# Altium schematic sheet SCROD_CONN_A2.SchDoc: SCROD_CONN
size 401 x 291 mm; DocumentNumber: 3; SheetNumber: 3; SheetTotal: 3
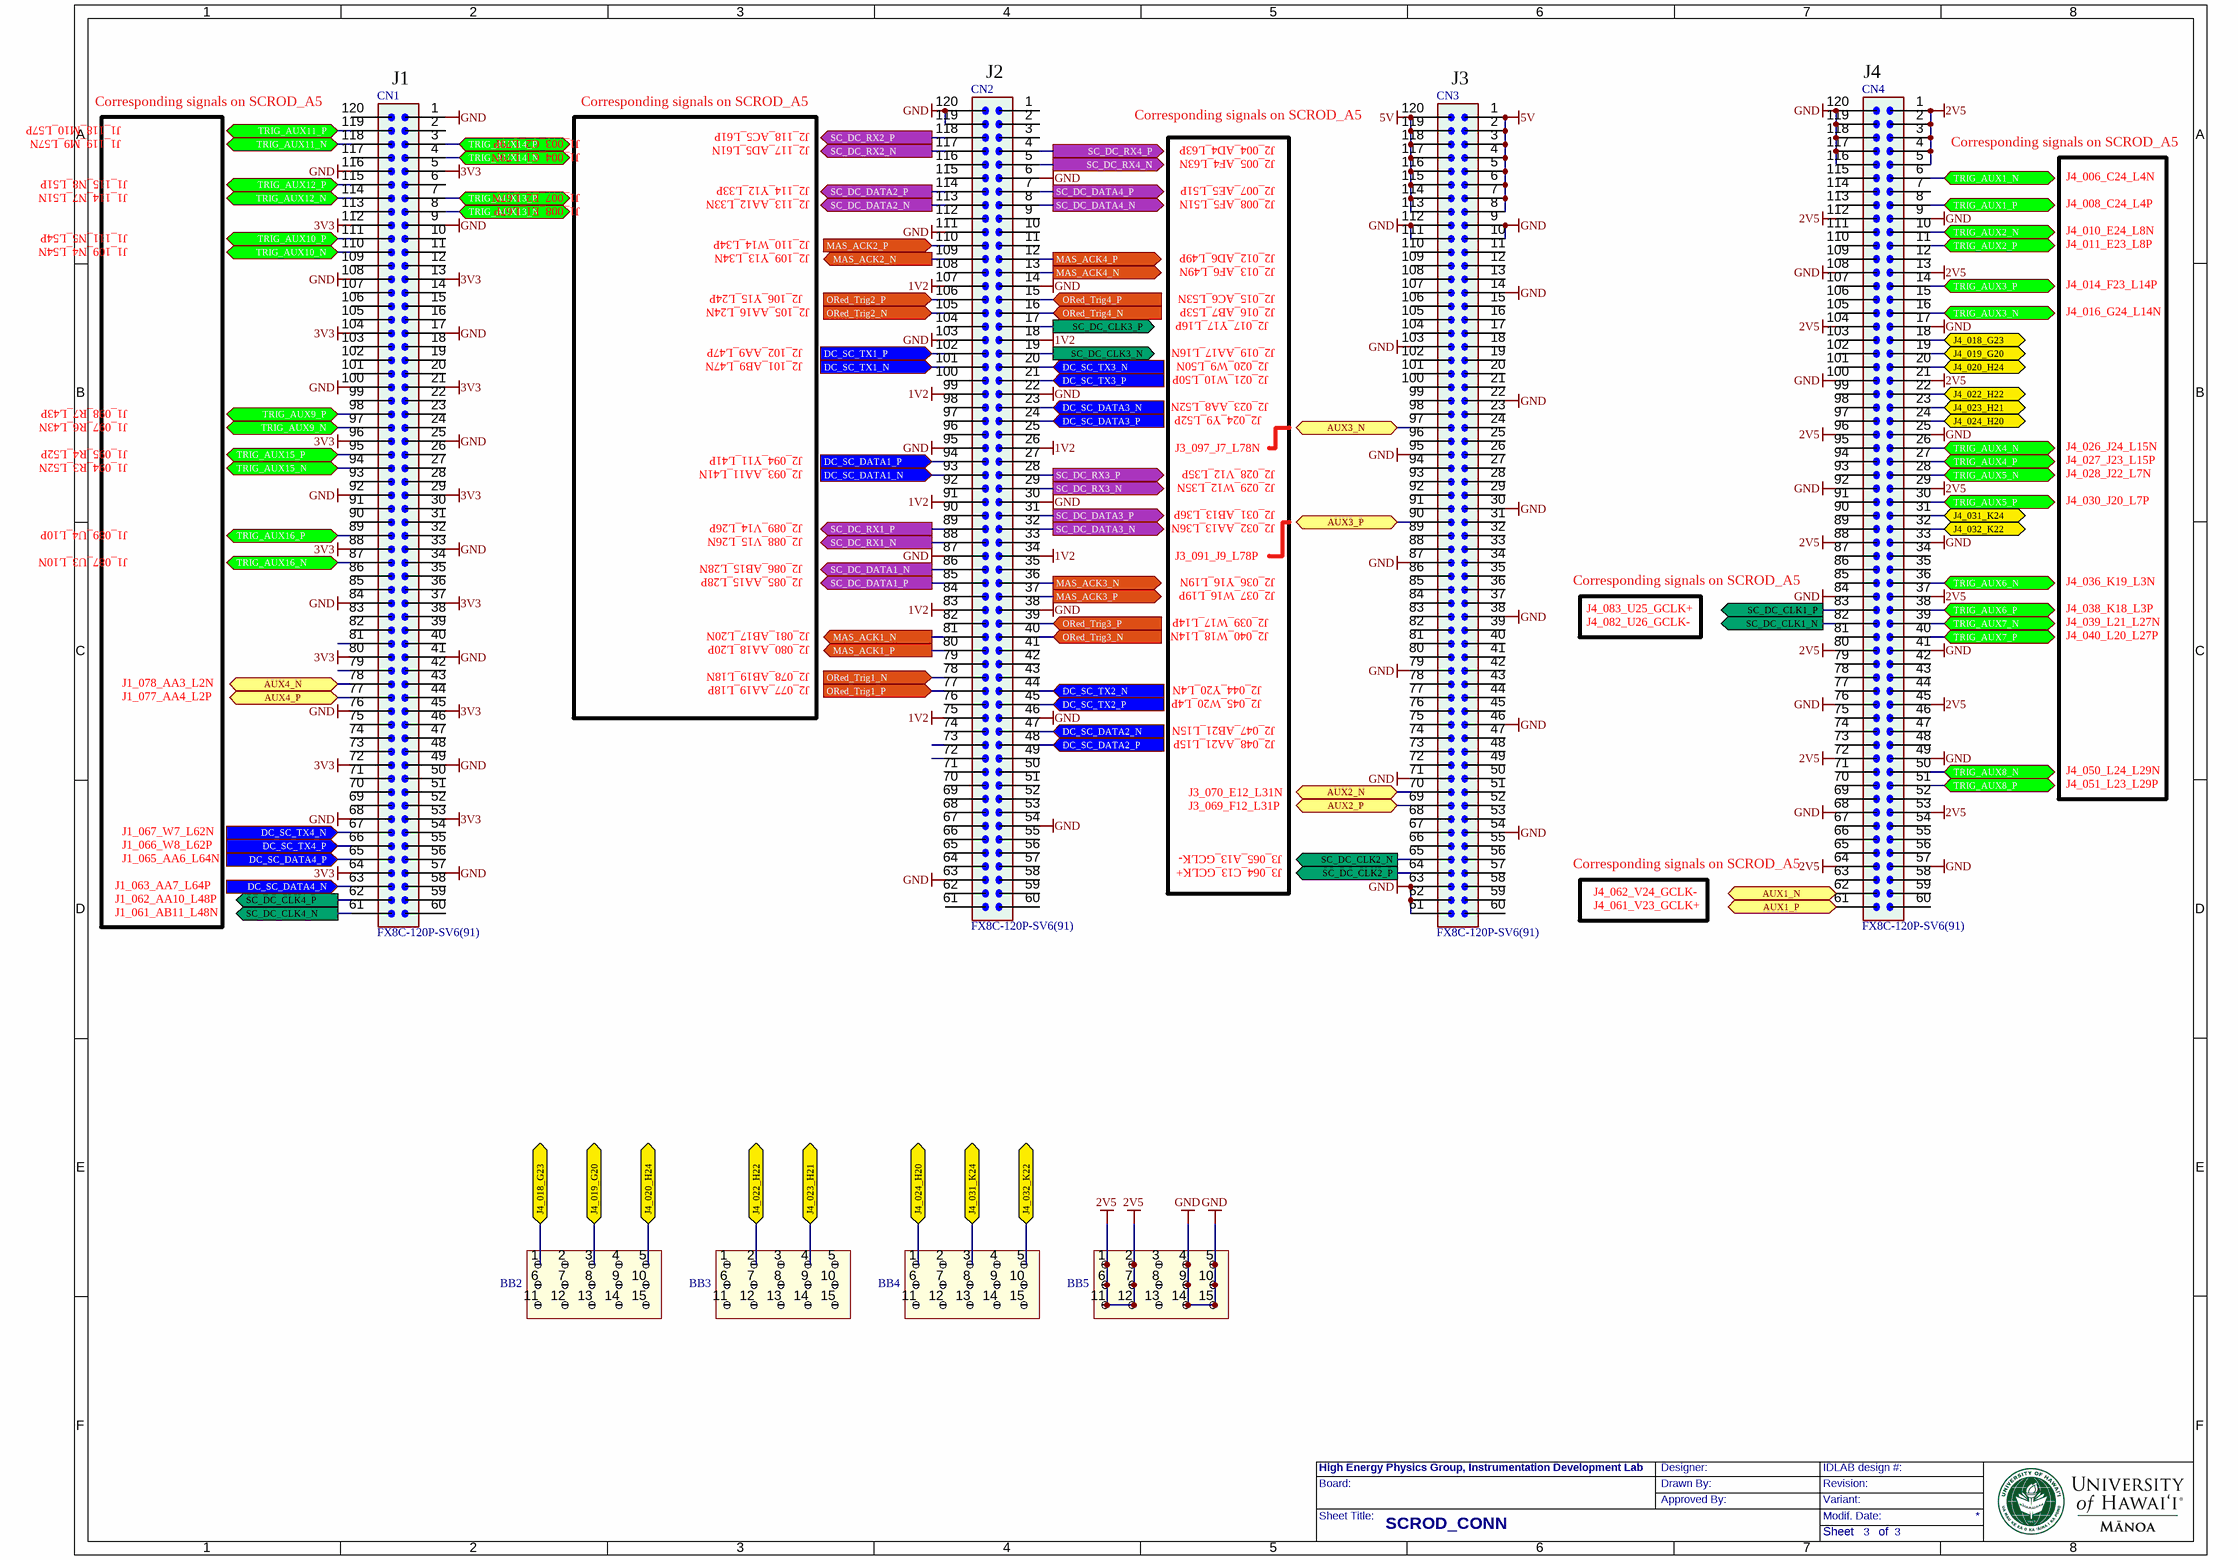
[diagram p0: SCROD_CONN_A2.SchDoc]

## Parts
BB2  (no value)  [Breadboard_3x5_100mil_pitch]
BB3  (no value)  [Breadboard_3x5_100mil_pitch]
BB4  (no value)  [Breadboard_3x5_100mil_pitch]
BB5  (no value)  [Breadboard_3x5_100mil_pitch]
CN1  FX8C-120P-SV6(91)  [FX8C-120P-SV6(91)]
CN2  FX8C-120P-SV6(91)  [FX8C-120P-SV6(91)]
CN3  FX8C-120P-SV6(91)  [FX8C-120P-SV6(91)]
CN4  FX8C-120P-SV6(91)  [FX8C-120P-SV6(91)]

## Ports
AUX1_N (bidir), AUX1_P (bidir), AUX2_N (bidir), AUX2_P (bidir), AUX3_N (bidir), AUX3_P (bidir), AUX4_N (bidir), AUX4_P (bidir), DC_SC_DATA1_N (in), DC_SC_DATA1_P (in), DC_SC_DATA2_N (in), DC_SC_DATA2_P (in), DC_SC_DATA3_N (in), DC_SC_DATA3_P (in), DC_SC_DATA4_N (in), DC_SC_DATA4_P (in), DC_SC_TX1_N (in), DC_SC_TX1_P (in), DC_SC_TX2_N (in), DC_SC_TX2_P (in), DC_SC_TX3_N (in), DC_SC_TX3_P (in), DC_SC_TX4_N (in), DC_SC_TX4_P (in), J4_018_G23 (bidir), J4_019_G20 (bidir), J4_020_H24 (bidir), J4_022_H22 (bidir), J4_023_H21 (bidir), J4_024_H20 (bidir), J4_031_K24 (bidir), J4_032_K22 (bidir), MAS_ACK1_N (out), MAS_ACK1_P (out), MAS_ACK2_N (out), MAS_ACK2_P (in), MAS_ACK3_N (out), MAS_ACK3_P (out), MAS_ACK4_N (out), MAS_ACK4_P (out), ORed_Trig1_N (in), ORed_Trig1_P (in), ORed_Trig2_N (in), ORed_Trig2_P (in), ORed_Trig3_N (in), ORed_Trig3_P (in), ORed_Trig4_N (in), ORed_Trig4_P (in), SC_DC_CLK1_N (out), SC_DC_CLK1_P (out), SC_DC_CLK2_N (out), SC_DC_CLK2_P (out), SC_DC_CLK3_N (out), SC_DC_CLK3_P (out), SC_DC_CLK4_N (out), SC_DC_CLK4_P (out), SC_DC_DATA1_N (out), SC_DC_DATA1_P (out), SC_DC_DATA2_N (out), SC_DC_DATA2_P (out), SC_DC_DATA3_N (out), SC_DC_DATA3_P (out), SC_DC_DATA4_N (out), SC_DC_DATA4_P (out), SC_DC_RX1_N (out), SC_DC_RX1_P (out), SC_DC_RX2_N (out), SC_DC_RX2_P (out), SC_DC_RX3_N (out), SC_DC_RX3_P (out), SC_DC_RX4_N (out), SC_DC_RX4_P (out), TRIG_AUX1_N (bidir), TRIG_AUX1_P (bidir), TRIG_AUX2_N (bidir), TRIG_AUX2_P (bidir), TRIG_AUX3_N (bidir), TRIG_AUX3_P (bidir), TRIG_AUX4_N (bidir), TRIG_AUX4_P (bidir), TRIG_AUX5_N (bidir), TRIG_AUX5_P (bidir), TRIG_AUX6_N (bidir), TRIG_AUX6_P (bidir), TRIG_AUX7_N (bidir), TRIG_AUX7_P (bidir), TRIG_AUX8_N (bidir), TRIG_AUX8_P (bidir), TRIG_AUX9_N (bidir), TRIG_AUX9_P (bidir), TRIG_AUX10_N (bidir), TRIG_AUX10_P (bidir), TRIG_AUX11_N (bidir), TRIG_AUX11_P (bidir), TRIG_AUX12_N (bidir), TRIG_AUX12_P (bidir), TRIG_AUX13_N (bidir), TRIG_AUX13_P (bidir), TRIG_AUX14_N (bidir), TRIG_AUX14_P (bidir), TRIG_AUX15_N (bidir), TRIG_AUX15_P (bidir), TRIG_AUX16_N (bidir), TRIG_AUX16_P (bidir)

## Nets
1V2: CN2.18 CN2.26 CN2.34 CN2.75 CN2.83 CN2.91 CN2.99 CN2.107
2V5: BB5.1 BB5.2 BB5.6 BB5.7 BB5.11 BB5.12 CN4.1 CN4.2 CN4.3 CN4.4 CN4.5 CN4.13 CN4.21 CN4.29 CN4.37 CN4.45 CN4.53 CN4.64 CN4.72 CN4.80 CN4.88 CN4.96 CN4.104 CN4.112
3V3: CN1.5 CN1.13 CN1.21 CN1.29 CN1.37 CN1.45 CN1.53 CN1.64 CN1.72 CN1.80 CN1.88 CN1.96 CN1.104 CN1.112
5V: CN3.1 CN3.2 CN3.3 CN3.4 CN3.5 CN3.6 CN3.7 CN3.8 CN3.113 CN3.114 CN3.115 CN3.116 CN3.117 CN3.118 CN3.119 CN3.120
GND: BB5.4 BB5.5 BB5.9 BB5.10 BB5.14 BB5.15 CN1.1 CN1.9 CN1.17 CN1.25 CN1.33 CN1.41 CN1.49 CN1.57 CN1.68 CN1.76 CN1.84 CN1.92 CN1.100 CN1.108 CN1.116 CN2.6 CN2.14 CN2.22 CN2.30 CN2.38 CN2.46 CN2.54 CN2.63 CN2.87 CN2.95 CN2.103 CN2.111 CN2.119 CN2.120 CN3.9 CN3.10 CN3.14 CN3.22 CN3.30 CN3.38 CN3.46 CN3.54 CN3.61 CN3.62 CN3.63 CN3.71 CN3.79 CN3.87 CN3.95 CN3.103 CN3.111 CN3.112 CN4.9 CN4.17 CN4.25 CN4.33 CN4.41 CN4.49 CN4.57 CN4.68 CN4.76 CN4.84 CN4.92 CN4.100 CN4.108 CN4.116 CN4.117 CN4.118 CN4.119 CN4.120
AUX1_N: CN4.62 ; port AUX1_N
AUX1_P: CN4.61 ; port AUX1_P
AUX2_N: CN3.70 ; port AUX2_N
AUX2_P: CN3.69 ; port AUX2_P
AUX3_N: CN3.97 ; port AUX3_N
AUX3_P: CN3.90 ; port AUX3_P
AUX4_N: CN1.78 ; port AUX4_N
AUX4_P: CN1.77 ; port AUX4_P
DC_SC_DATA1_N: CN2.93 ; port DC_SC_DATA1_N
DC_SC_DATA1_P: CN2.94 ; port DC_SC_DATA1_P
DC_SC_DATA2_N: CN2.47 ; port DC_SC_DATA2_N
DC_SC_DATA2_P: CN2.48 ; port DC_SC_DATA2_P
DC_SC_DATA3_N: CN2.23 ; port DC_SC_DATA3_N
DC_SC_DATA3_P: CN2.24 ; port DC_SC_DATA3_P
DC_SC_DATA4_N: CN1.63 ; port DC_SC_DATA4_N
DC_SC_DATA4_P: CN1.65 ; port DC_SC_DATA4_P
DC_SC_TX1_N: CN2.101 ; port DC_SC_TX1_N
DC_SC_TX1_P: CN2.102 ; port DC_SC_TX1_P
DC_SC_TX2_N: CN2.44 ; port DC_SC_TX2_N
DC_SC_TX2_P: CN2.45 ; port DC_SC_TX2_P
DC_SC_TX3_N: CN2.20 ; port DC_SC_TX3_N
DC_SC_TX3_P: CN2.21 ; port DC_SC_TX3_P
DC_SC_TX4_N: CN1.67 ; port DC_SC_TX4_N
DC_SC_TX4_P: CN1.66 ; port DC_SC_TX4_P
J4_018_G23: BB2.1 CN4.18 ; port J4_018_G23
J4_019_G20: BB2.3 CN4.19 ; port J4_019_G20
J4_020_H24: BB2.5 CN4.20 ; port J4_020_H24
J4_022_H22: BB3.2 CN4.22 ; port J4_022_H22
J4_023_H21: BB3.4 CN4.23 ; port J4_023_H21
J4_024_H20: BB4.1 CN4.24 ; port J4_024_H20
J4_031_K24: BB4.3 CN4.31 ; port J4_031_K24
J4_032_K22: BB4.5 CN4.32 ; port J4_032_K22
MAS_ACK1_N: CN2.81 ; port MAS_ACK1_N
MAS_ACK1_P: CN2.80 ; port MAS_ACK1_P
MAS_ACK2_N: CN2.109 ; port MAS_ACK2_N
MAS_ACK2_P: CN2.110 ; port MAS_ACK2_P
MAS_ACK3_N: CN2.36 ; port MAS_ACK3_N
MAS_ACK3_P: CN2.37 ; port MAS_ACK3_P
MAS_ACK4_N: CN2.13 ; port MAS_ACK4_N
MAS_ACK4_P: CN2.12 ; port MAS_ACK4_P
ORed_Trig1_N: CN2.78 ; port ORed_Trig1_N
ORed_Trig1_P: CN2.77 ; port ORed_Trig1_P
ORed_Trig2_N: CN2.105 ; port ORed_Trig2_N
ORed_Trig2_P: CN2.106 ; port ORed_Trig2_P
ORed_Trig3_N: CN2.40 ; port ORed_Trig3_N
ORed_Trig3_P: CN2.39 ; port ORed_Trig3_P
ORed_Trig4_N: CN2.16 ; port ORed_Trig4_N
ORed_Trig4_P: CN2.15 ; port ORed_Trig4_P
SC_DC_CLK1_N: CN4.82 ; port SC_DC_CLK1_N
SC_DC_CLK1_P: CN4.83 ; port SC_DC_CLK1_P
SC_DC_CLK2_N: CN3.65 ; port SC_DC_CLK2_N
SC_DC_CLK2_P: CN3.64 ; port SC_DC_CLK2_P
SC_DC_CLK3_N: CN2.19 ; port SC_DC_CLK3_N
SC_DC_CLK3_P: CN2.17 ; port SC_DC_CLK3_P
SC_DC_CLK4_N: CN1.61 ; port SC_DC_CLK4_N
SC_DC_CLK4_P: CN1.62 ; port SC_DC_CLK4_P
SC_DC_DATA1_N: CN2.86 ; port SC_DC_DATA1_N
SC_DC_DATA1_P: CN2.85 ; port SC_DC_DATA1_P
SC_DC_DATA2_N: CN2.113 ; port SC_DC_DATA2_N
SC_DC_DATA2_P: CN2.114 ; port SC_DC_DATA2_P
SC_DC_DATA3_N: CN2.32 ; port SC_DC_DATA3_N
SC_DC_DATA3_P: CN2.31 ; port SC_DC_DATA3_P
SC_DC_DATA4_N: CN2.8 ; port SC_DC_DATA4_N
SC_DC_DATA4_P: CN2.7 ; port SC_DC_DATA4_P
SC_DC_RX1_N: CN2.88 ; port SC_DC_RX1_N
SC_DC_RX1_P: CN2.89 ; port SC_DC_RX1_P
SC_DC_RX2_N: CN2.117 ; port SC_DC_RX2_N
SC_DC_RX2_P: CN2.118 ; port SC_DC_RX2_P
SC_DC_RX3_N: CN2.29 ; port SC_DC_RX3_N
SC_DC_RX3_P: CN2.28 ; port SC_DC_RX3_P
SC_DC_RX4_N: CN2.5 ; port SC_DC_RX4_N
SC_DC_RX4_P: CN2.4 ; port SC_DC_RX4_P
TRIG_AUX1_N: CN4.6 ; port TRIG_AUX1_N
TRIG_AUX1_P: CN4.8 ; port TRIG_AUX1_P
TRIG_AUX2_N: CN4.10 ; port TRIG_AUX2_N
TRIG_AUX2_P: CN4.11 ; port TRIG_AUX2_P
TRIG_AUX3_N: CN4.16 ; port TRIG_AUX3_N
TRIG_AUX3_P: CN4.14 ; port TRIG_AUX3_P
TRIG_AUX4_N: CN4.26 ; port TRIG_AUX4_N
TRIG_AUX4_P: CN4.27 ; port TRIG_AUX4_P
TRIG_AUX5_N: CN4.28 ; port TRIG_AUX5_N
TRIG_AUX5_P: CN4.30 ; port TRIG_AUX5_P
TRIG_AUX6_N: CN4.36 ; port TRIG_AUX6_N
TRIG_AUX6_P: CN4.38 ; port TRIG_AUX6_P
TRIG_AUX7_N: CN4.39 ; port TRIG_AUX7_N
TRIG_AUX7_P: CN4.40 ; port TRIG_AUX7_P
TRIG_AUX8_N: CN4.50 ; port TRIG_AUX8_N
TRIG_AUX8_P: CN4.51 ; port TRIG_AUX8_P
TRIG_AUX9_N: CN1.97 ; port TRIG_AUX9_N
TRIG_AUX9_P: CN1.98 ; port TRIG_AUX9_P
TRIG_AUX10_N: CN1.110 ; port TRIG_AUX10_N
TRIG_AUX10_P: CN1.111 ; port TRIG_AUX10_P
TRIG_AUX11_N: CN1.118 ; port TRIG_AUX11_N
TRIG_AUX11_P: CN1.119 ; port TRIG_AUX11_P
TRIG_AUX12_N: CN1.114 ; port TRIG_AUX12_N
TRIG_AUX12_P: CN1.115 ; port TRIG_AUX12_P
TRIG_AUX13_N: CN1.8 ; port TRIG_AUX13_N
TRIG_AUX13_P: CN1.7 ; port TRIG_AUX13_P
TRIG_AUX14_N: CN1.4 ; port TRIG_AUX14_N
TRIG_AUX14_P: CN1.3 ; port TRIG_AUX14_P
TRIG_AUX15_N: CN1.94 ; port TRIG_AUX15_N
TRIG_AUX15_P: CN1.95 ; port TRIG_AUX15_P
TRIG_AUX16_N: CN1.87 ; port TRIG_AUX16_N
TRIG_AUX16_P: CN1.89 ; port TRIG_AUX16_P

Not connected (* = marked no-connect by the designer): BB2 2 4 6 7 8 9 10 11 12 13 14 15; BB3 1 3 5 6 7 8 9 10 11 12 13 14 15; BB4 2 4 6 7 8 9 10 11 12 13 14 15; BB5 3 8 13; CN1 2 6 10 11 12 14 15 16 18 19 20 22 23 24 26 27 28 30 31 32 34 35 36 38 39 40 42 43 44 46 47 48 50 51 52 54 55 56 58 59 60 69 70 71 73 74 75 79 81 82 83 85 86 90 91 93 99 101 102 103 105 106 107 109 113 117 120; CN2 1 2 3 9 10 11 25 27 33 35 41 42 43 49 50 51 52 53 55 56 57 58 59 60 61 62 64 65 66 67 68 69 70 71 72 73 74 76 79 82 84 90 92 96 97 98 100 104 108 112 115 116; CN3 11 12 13 15 16 17 18 19 20 21 23 24 25 26 27 28 29 31 32 33 34 35 36 37 39 40 41 42 43 44 45 47 48 49 50 51 52 53 55 56 57 58 59 60 66 67 68 72 73 74 75 76 77 78 80 81 82 83 84 85 86 88 89 91 92 93 94 96 98 99 100 101 102 104 105 106 107 108 109 110; CN4 7 12 15 34 35 42 43 44 46 47 48 52 54 55 56 58 59 60 63 65 66 67 69 70 71 73 74 75 77 78 79 81 85 86 87 89 90 91 93 94 95 97 98 99 101 102 103 105 106 107 109 110 111 113 114 115

## Notes on the sheet
- (near CN1) J1
- (near CN2) J2
- (near CN3) J3
- (near CN4) J4
- (near CN1) Corresponding signals on SCROD_A5
- J1_119_M9_L57N
- J1_118_M10_L57P
- Corresponding signals on SCROD_A5
- J1_003_C2_L79P
- J1_004_C1_L79N
- J2_118_AC5_L61P
- J2_117_AD5_L61N
- J2_004_AD4_L63P
- J2_005_AF4_L63N
- (near CN4) Corresponding signals on SCROD_A5
- J1_115_N8_L51P
- J1_114_N7_L51N
- J1_111_N5_L54P
- J1_007_E2_L67N
- J1_008_E1_L67P
- J2_114_Y12_L33P
- J2_113_AA12_L33N
- J2_007_AE5_L51P
- J2_008_AF5_L51N
- J4_006_C24_L4N
- J4_008_C24_L4P
- J4_010_E24_L8N
- J1_109_N4_L54N
- J2_106_Y15_L24P
- J2_110_W14_L34P
- J2_109_Y13_L34N
- J2_012_AD6_L49P
- J2_015_AC6_L53N
- J2_013_AF6_L49N
- J4_011_E23_L8P
- J4_014_F23_L14P
- J2_102_AA9_L47P
- J2_101_AB9_L47N
- J2_105_AA16_L24N
- J2_017_Y17_L16P
- J2_020_W9_L50N
- J2_016_AB7_L53P
- J2_019_AA17_L16N
- J4_016_G24_L14N
- J1_098_R7_L43P
- J1_097_R6_L43N
- J2_024_Y9_L52P
- J2_023_AA8_L52N
- J2_021_W10_L50P
- J1_095_R4_L52P
- J1_094_R3_L52N
- J2_094_Y11_L41P
- J2_093_AA11_L41N
- J3_097_J7_L78N
- J2_028_V12_L35P
- J2_029_W12_L35N
- J4_026_J24_L15N
- J4_027_J23_L15P
- J4_028_J22_L7N
- J4_030_J20_L7P
- J1_089_U4_L10P
- J1_087_U3_L10N
- J2_089_V14_L26P
- J2_088_V15_L26N
- J2_086_AB15_L28N
- J3_091_J9_L78P
- J2_031_AB13_L36P
- J2_032_AA13_L36N
- J2_085_AA15_L28P
- J2_081_AB17_L20N
- J2_039_W17_L14P
- J2_040_W18_L14N
- J2_036_Y16_L19N
- J2_037_W16_L19P
- J4_083_U25_GCLK+
- J4_082_U26_GCLK-
- J4_036_K19_L3N
- J4_038_K18_L3P
- J4_039_L21_L27N
- J4_040_L20_L27P
- J1_077_AA4_L2P
- J1_078_AA3_L2N
- J2_080_AA18_L20P
- J2_078_AB19_L18N
- J2_077_AA19_L18P
- J2_044_Y20_L4N
- J2_045_W20_L4P
- J2_047_AB21_L15N
- J2_048_AA21_L15P
- J4_050_L24_L29N
- J1_067_W7_L62N
- J3_069_F12_L31P
- J3_070_E12_L31N
- J4_051_L23_L29P
- J1_062_AA10_L48P
- J1_063_AA7_L64P
- J1_065_AA6_L64N
- J1_066_W8_L62P
- J3_064_C13_GCLK+
- J3_065_A13_GCLK-
- J4_061_V23_GCLK+
- J4_062_V24_GCLK-
- J1_061_AB11_L48N
- Board:
- High Energy Physics Group, Instrumentation Development Lab
- Drawn By:
- Designer:
- Approved By:
- Revision:
- IDLAB design #:
- Variant:
- Sheet Title:
- Modif. Date:
- Sheet       of

## Library data of the parts
BB2-BB5 = 3X5 Breadboard: 3X5 100mil pitch Breadboard; Tech: Surface Mount
CN1-CN4 = CN_FX8C-120P-SV6(91): Hirose Connector 120pin SMD R0.6mm male; Comment2: 120pin Header 10.45mm; Sort: 610; Tech: SMDR; Manufacturer: Hirose; Manufacturer No: FX8C-120P-SV6(91); Package: 120pin SMD; Price: 5.69; Supplier: Digi-Key; Supplier No: H11527-ND